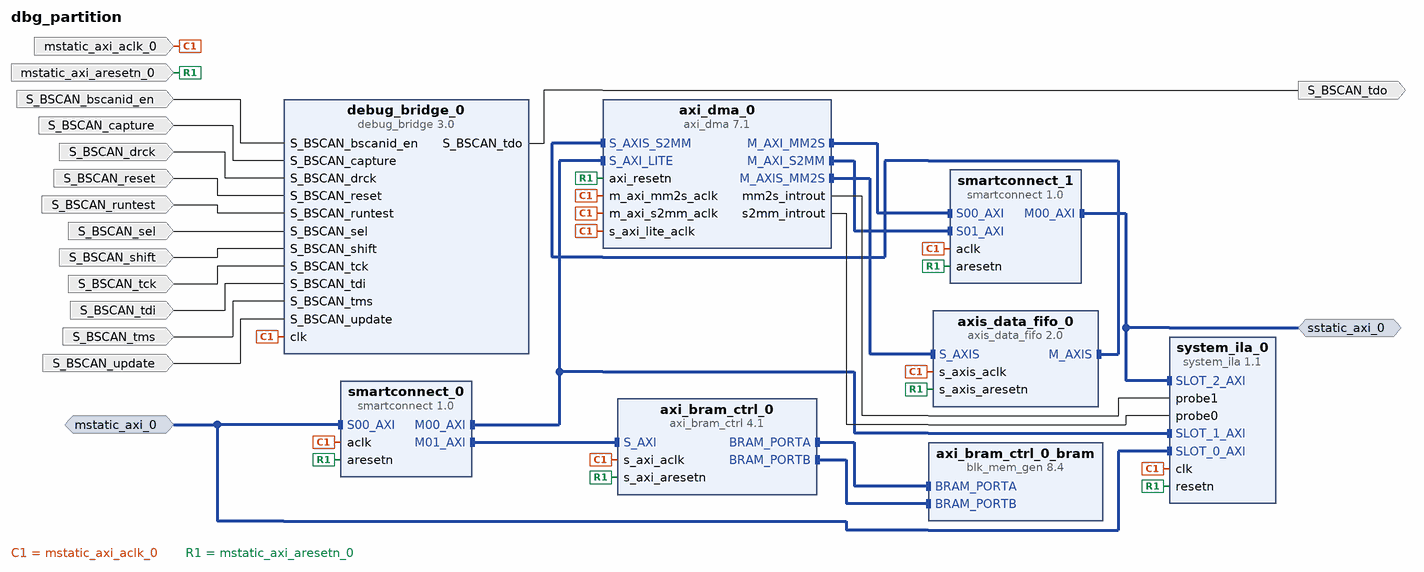
[diagram p0: block diagram of the top level]
# Vivado block design dbg_partition, xcu250-figd2104-2L-e, Vivado 2024.2
create_bd_design dbg_partition

create_bd_intf_port -mode Slave -vlnv xilinx.com:interface:aximm_rtl:1.0 mstatic_axi_0
set_property -dict [list \
  CONFIG.ADDR_WIDTH 37 \
  CONFIG.ARUSER_WIDTH 0 \
  CONFIG.AWUSER_WIDTH 0 \
  CONFIG.BUSER_WIDTH 0 \
  CONFIG.DATA_WIDTH 512 \
  CONFIG.HAS_BRESP 1 \
  CONFIG.HAS_BURST 1 \
  CONFIG.HAS_CACHE 1 \
  CONFIG.HAS_LOCK 1 \
  CONFIG.HAS_PROT 1 \
  CONFIG.HAS_QOS 0 \
  CONFIG.HAS_REGION 0 \
  CONFIG.HAS_RRESP 1 \
  CONFIG.HAS_WSTRB 1 \
  CONFIG.ID_WIDTH 0 \
  CONFIG.MAX_BURST_LENGTH 256 \
  CONFIG.NUM_READ_OUTSTANDING 2 \
  CONFIG.NUM_READ_THREADS 1 \
  CONFIG.NUM_WRITE_OUTSTANDING 2 \
  CONFIG.NUM_WRITE_THREADS 1 \
  CONFIG.PROTOCOL AXI4 \
  CONFIG.READ_WRITE_MODE READ_WRITE \
  CONFIG.RUSER_BITS_PER_BYTE 0 \
  CONFIG.RUSER_WIDTH 0 \
  CONFIG.SUPPORTS_NARROW_BURST 1 \
  CONFIG.WUSER_BITS_PER_BYTE 0 \
  CONFIG.WUSER_WIDTH 0 \
] [get_bd_intf_ports mstatic_axi_0]
create_bd_intf_port -mode Master -vlnv xilinx.com:interface:aximm_rtl:1.0 sstatic_axi_0
set_property -dict {CONFIG.ADDR_WIDTH 37 CONFIG.DATA_WIDTH 512 CONFIG.PROTOCOL AXI4} [get_bd_intf_ports sstatic_axi_0]
create_bd_port -dir I -type clk mstatic_axi_aclk_0
set_property -dict [list \
  CONFIG.ASSOCIATED_BUSIF mstatic_axi_0:sstatic_axi_0 \
  CONFIG.ASSOCIATED_RESET mstatic_axi_aresetn_0 \
] [get_bd_ports mstatic_axi_aclk_0]
create_bd_port -dir I -type rst mstatic_axi_aresetn_0
create_bd_port -dir I S_BSCAN_drck
create_bd_port -dir O S_BSCAN_tdo
create_bd_port -dir I S_BSCAN_shift
create_bd_port -dir I S_BSCAN_tdi
create_bd_port -dir I S_BSCAN_update
create_bd_port -dir I S_BSCAN_sel
create_bd_port -dir I S_BSCAN_tms
create_bd_port -dir I S_BSCAN_tck
create_bd_port -dir I S_BSCAN_runtest
create_bd_port -dir I S_BSCAN_reset
create_bd_port -dir I S_BSCAN_capture
create_bd_port -dir I S_BSCAN_bscanid_en

create_bd_cell -type ip -vlnv xilinx.com:ip:axi_bram_ctrl:4.1 axi_bram_ctrl_0
create_bd_cell -type ip -vlnv xilinx.com:ip:blk_mem_gen:8.4 axi_bram_ctrl_0_bram
set_property -dict [list \
  CONFIG.Enable_B Use_ENB_Pin \
  CONFIG.Memory_Type True_Dual_Port_RAM \
  CONFIG.Port_B_Clock 100 \
  CONFIG.Port_B_Enable_Rate 100 \
  CONFIG.Port_B_Write_Rate 50 \
  CONFIG.Use_RSTB_Pin true \
] [get_bd_cells axi_bram_ctrl_0_bram]
create_bd_cell -type ip -vlnv xilinx.com:ip:axi_dma:7.1 axi_dma_0
set_property -dict [list \
  CONFIG.c_addr_width 37 \
  CONFIG.c_include_sg 0 \
  CONFIG.c_m_axi_mm2s_data_width 32 \
  CONFIG.c_sg_length_width 26 \
] [get_bd_cells axi_dma_0]
create_bd_cell -type ip -vlnv xilinx.com:ip:axis_data_fifo:2.0 axis_data_fifo_0
set_property -dict {CONFIG.FIFO_DEPTH 16} [get_bd_cells axis_data_fifo_0]
create_bd_cell -type ip -vlnv xilinx.com:ip:smartconnect:1.0 smartconnect_0
set_property -dict {CONFIG.NUM_MI 2 CONFIG.NUM_SI 1} [get_bd_cells smartconnect_0]
create_bd_cell -type ip -vlnv xilinx.com:ip:smartconnect:1.0 smartconnect_1
set_property -dict {CONFIG.NUM_SI 2} [get_bd_cells smartconnect_1]
create_bd_cell -type ip -vlnv xilinx.com:ip:system_ila:1.1 system_ila_0
set_property -dict {CONFIG.C_MON_TYPE MIX CONFIG.C_NUM_MONITOR_SLOTS 3 CONFIG.C_NUM_OF_PROBES 3} [get_bd_cells system_ila_0]
create_bd_cell -type ip -vlnv xilinx.com:ip:debug_bridge:3.0 debug_bridge_0

# ---- connections ----

connect_bd_intf_net -intf_net S_AXI_0_1 [get_bd_intf_ports mstatic_axi_0] [get_bd_intf_pins smartconnect_0/S00_AXI]
connect_bd_intf_net [get_bd_intf_ports mstatic_axi_0] [get_bd_intf_pins system_ila_0/SLOT_0_AXI]
connect_bd_intf_net [get_bd_intf_pins axi_bram_ctrl_0_bram/BRAM_PORTA] [get_bd_intf_pins axi_bram_ctrl_0/BRAM_PORTA]
connect_bd_intf_net [get_bd_intf_pins axi_bram_ctrl_0_bram/BRAM_PORTB] [get_bd_intf_pins axi_bram_ctrl_0/BRAM_PORTB]
connect_bd_intf_net [get_bd_intf_pins axis_data_fifo_0/S_AXIS] [get_bd_intf_pins axi_dma_0/M_AXIS_MM2S]
connect_bd_intf_net [get_bd_intf_pins axi_dma_0/M_AXI_MM2S] [get_bd_intf_pins smartconnect_1/S00_AXI]
connect_bd_intf_net [get_bd_intf_pins axi_dma_0/M_AXI_S2MM] [get_bd_intf_pins smartconnect_1/S01_AXI]
connect_bd_intf_net [get_bd_intf_pins axis_data_fifo_0/M_AXIS] [get_bd_intf_pins axi_dma_0/S_AXIS_S2MM]
connect_bd_intf_net [get_bd_intf_pins axi_dma_0/S_AXI_LITE] [get_bd_intf_pins smartconnect_0/M00_AXI]
connect_bd_intf_net [get_bd_intf_pins axi_dma_0/S_AXI_LITE] [get_bd_intf_pins system_ila_0/SLOT_1_AXI]
connect_bd_intf_net [get_bd_intf_pins smartconnect_0/M01_AXI] [get_bd_intf_pins axi_bram_ctrl_0/S_AXI]
connect_bd_intf_net [get_bd_intf_ports sstatic_axi_0] [get_bd_intf_pins smartconnect_1/M00_AXI]
connect_bd_intf_net [get_bd_intf_ports sstatic_axi_0] [get_bd_intf_pins system_ila_0/SLOT_2_AXI]
connect_bd_net -net S_BSCAN_0_bscanid_en_1 [get_bd_ports S_BSCAN_bscanid_en] [get_bd_pins debug_bridge_0/S_BSCAN_bscanid_en]
connect_bd_net -net S_BSCAN_0_capture_1 [get_bd_ports S_BSCAN_capture] [get_bd_pins debug_bridge_0/S_BSCAN_capture]
connect_bd_net -net S_BSCAN_0_drck_1 [get_bd_ports S_BSCAN_drck] [get_bd_pins debug_bridge_0/S_BSCAN_drck]
connect_bd_net -net S_BSCAN_0_reset_1 [get_bd_ports S_BSCAN_reset] [get_bd_pins debug_bridge_0/S_BSCAN_reset]
connect_bd_net -net S_BSCAN_0_runtest_1 [get_bd_ports S_BSCAN_runtest] [get_bd_pins debug_bridge_0/S_BSCAN_runtest]
connect_bd_net -net S_BSCAN_0_sel_1 [get_bd_ports S_BSCAN_sel] [get_bd_pins debug_bridge_0/S_BSCAN_sel]
connect_bd_net -net S_BSCAN_0_shift_1 [get_bd_ports S_BSCAN_shift] [get_bd_pins debug_bridge_0/S_BSCAN_shift]
connect_bd_net -net S_BSCAN_0_tck_1 [get_bd_ports S_BSCAN_tck] [get_bd_pins debug_bridge_0/S_BSCAN_tck]
connect_bd_net -net S_BSCAN_0_tdi_1 [get_bd_ports S_BSCAN_tdi] [get_bd_pins debug_bridge_0/S_BSCAN_tdi]
connect_bd_net -net S_BSCAN_0_tms_1 [get_bd_ports S_BSCAN_tms] [get_bd_pins debug_bridge_0/S_BSCAN_tms]
connect_bd_net -net S_BSCAN_0_update_1 [get_bd_ports S_BSCAN_update] [get_bd_pins debug_bridge_0/S_BSCAN_update]
connect_bd_net [get_bd_pins axi_dma_0/mm2s_introut] [get_bd_pins system_ila_0/probe1]
connect_bd_net [get_bd_pins axi_dma_0/s2mm_introut] [get_bd_pins system_ila_0/probe0]
connect_bd_net [get_bd_pins debug_bridge_0/S_BSCAN_tdo] [get_bd_ports S_BSCAN_tdo]
connect_bd_net -net s_axi_aclk_0_1 [get_bd_ports mstatic_axi_aclk_0] \
  [get_bd_pins axi_bram_ctrl_0/s_axi_aclk] [get_bd_pins smartconnect_1/aclk] [get_bd_pins smartconnect_0/aclk] \
  [get_bd_pins axi_dma_0/s_axi_lite_aclk] [get_bd_pins axis_data_fifo_0/s_axis_aclk] [get_bd_pins system_ila_0/clk] \
  [get_bd_pins axi_dma_0/m_axi_mm2s_aclk] [get_bd_pins axi_dma_0/m_axi_s2mm_aclk] [get_bd_pins debug_bridge_0/clk]
connect_bd_net -net s_axi_aresetn_0_1 [get_bd_ports mstatic_axi_aresetn_0] \
  [get_bd_pins axi_bram_ctrl_0/s_axi_aresetn] [get_bd_pins smartconnect_1/aresetn] [get_bd_pins smartconnect_0/aresetn] \
  [get_bd_pins axi_dma_0/axi_resetn] [get_bd_pins axis_data_fifo_0/s_axis_aresetn] [get_bd_pins system_ila_0/resetn]

# ---- address map ----
assign_bd_address -offset 0x1000000000 -range 64G -target_address_space [get_bd_addr_spaces axi_dma_0/Data_MM2S] [get_bd_addr_segs sstatic_axi_0/Reg]
assign_bd_address -offset 0x1000000000 -range 64G -target_address_space [get_bd_addr_spaces axi_dma_0/Data_S2MM] [get_bd_addr_segs sstatic_axi_0/Reg]
assign_bd_address -offset 0x0000000000 -range 4K -target_address_space [get_bd_addr_spaces mstatic_axi_0] [get_bd_addr_segs axi_bram_ctrl_0/S_AXI/Mem0]
assign_bd_address -offset 0x0000010000 -range 4K -target_address_space [get_bd_addr_spaces mstatic_axi_0] [get_bd_addr_segs axi_dma_0/S_AXI_LITE/Reg]

validate_bd_design
save_bd_design
